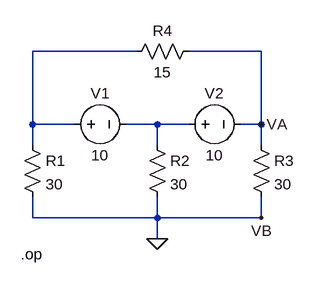
[diagram p0: schematic thevenin2.asc]
thevenin2.asc, the LTspice schematic file:
Version 4
SHEET 1 880 680
WIRE 144 32 -16 32
WIRE 336 32 224 32
WIRE -16 144 -16 32
WIRE 48 144 -16 144
WIRE 176 144 128 144
WIRE 224 144 176 144
WIRE 336 144 336 32
WIRE 336 144 304 144
WIRE -16 176 -16 144
WIRE 176 176 176 144
WIRE 336 176 336 144
WIRE -16 288 -16 256
WIRE 176 288 176 256
WIRE 176 288 -16 288
WIRE 336 288 336 256
WIRE 336 288 176 288
WIRE 176 320 176 288
FLAG 176 320 0
FLAG 336 144 VA
FLAG 336 288 VB
SYMBOL voltage 32 144 R270
WINDOW 0 32 56 VTop 2
WINDOW 3 -32 56 VBottom 2
WINDOW 123 0 0 Left 0
WINDOW 39 0 0 Left 0
SYMATTR InstName V1
SYMATTR Value 10
SYMBOL voltage 208 144 R270
WINDOW 0 32 56 VTop 2
WINDOW 3 -32 56 VBottom 2
WINDOW 123 0 0 Left 0
WINDOW 39 0 0 Left 0
SYMATTR InstName V2
SYMATTR Value 10
SYMBOL res -32 160 R0
SYMATTR InstName R1
SYMATTR Value 30
SYMBOL res 160 160 R0
SYMATTR InstName R2
SYMATTR Value 30
SYMBOL res 320 160 R0
SYMATTR InstName R3
SYMATTR Value 30
SYMBOL res 240 16 R90
WINDOW 0 0 56 VBottom 2
WINDOW 3 32 56 VTop 2
SYMATTR InstName R4
SYMATTR Value 15
TEXT -34 344 Left 2 !.op

The netlist it stands for:
* thevenin2.asc
V1 N001 N002 10
V2 N002 VA 10
R1 N001 0 30
R2 N002 0 30
R3 VA 0 30
R4 VA N001 15
.op
.backanno
.end